# EAGLE design tvc-gamecard-GAL-v2.2.1 (EAGLE 8.3.1)
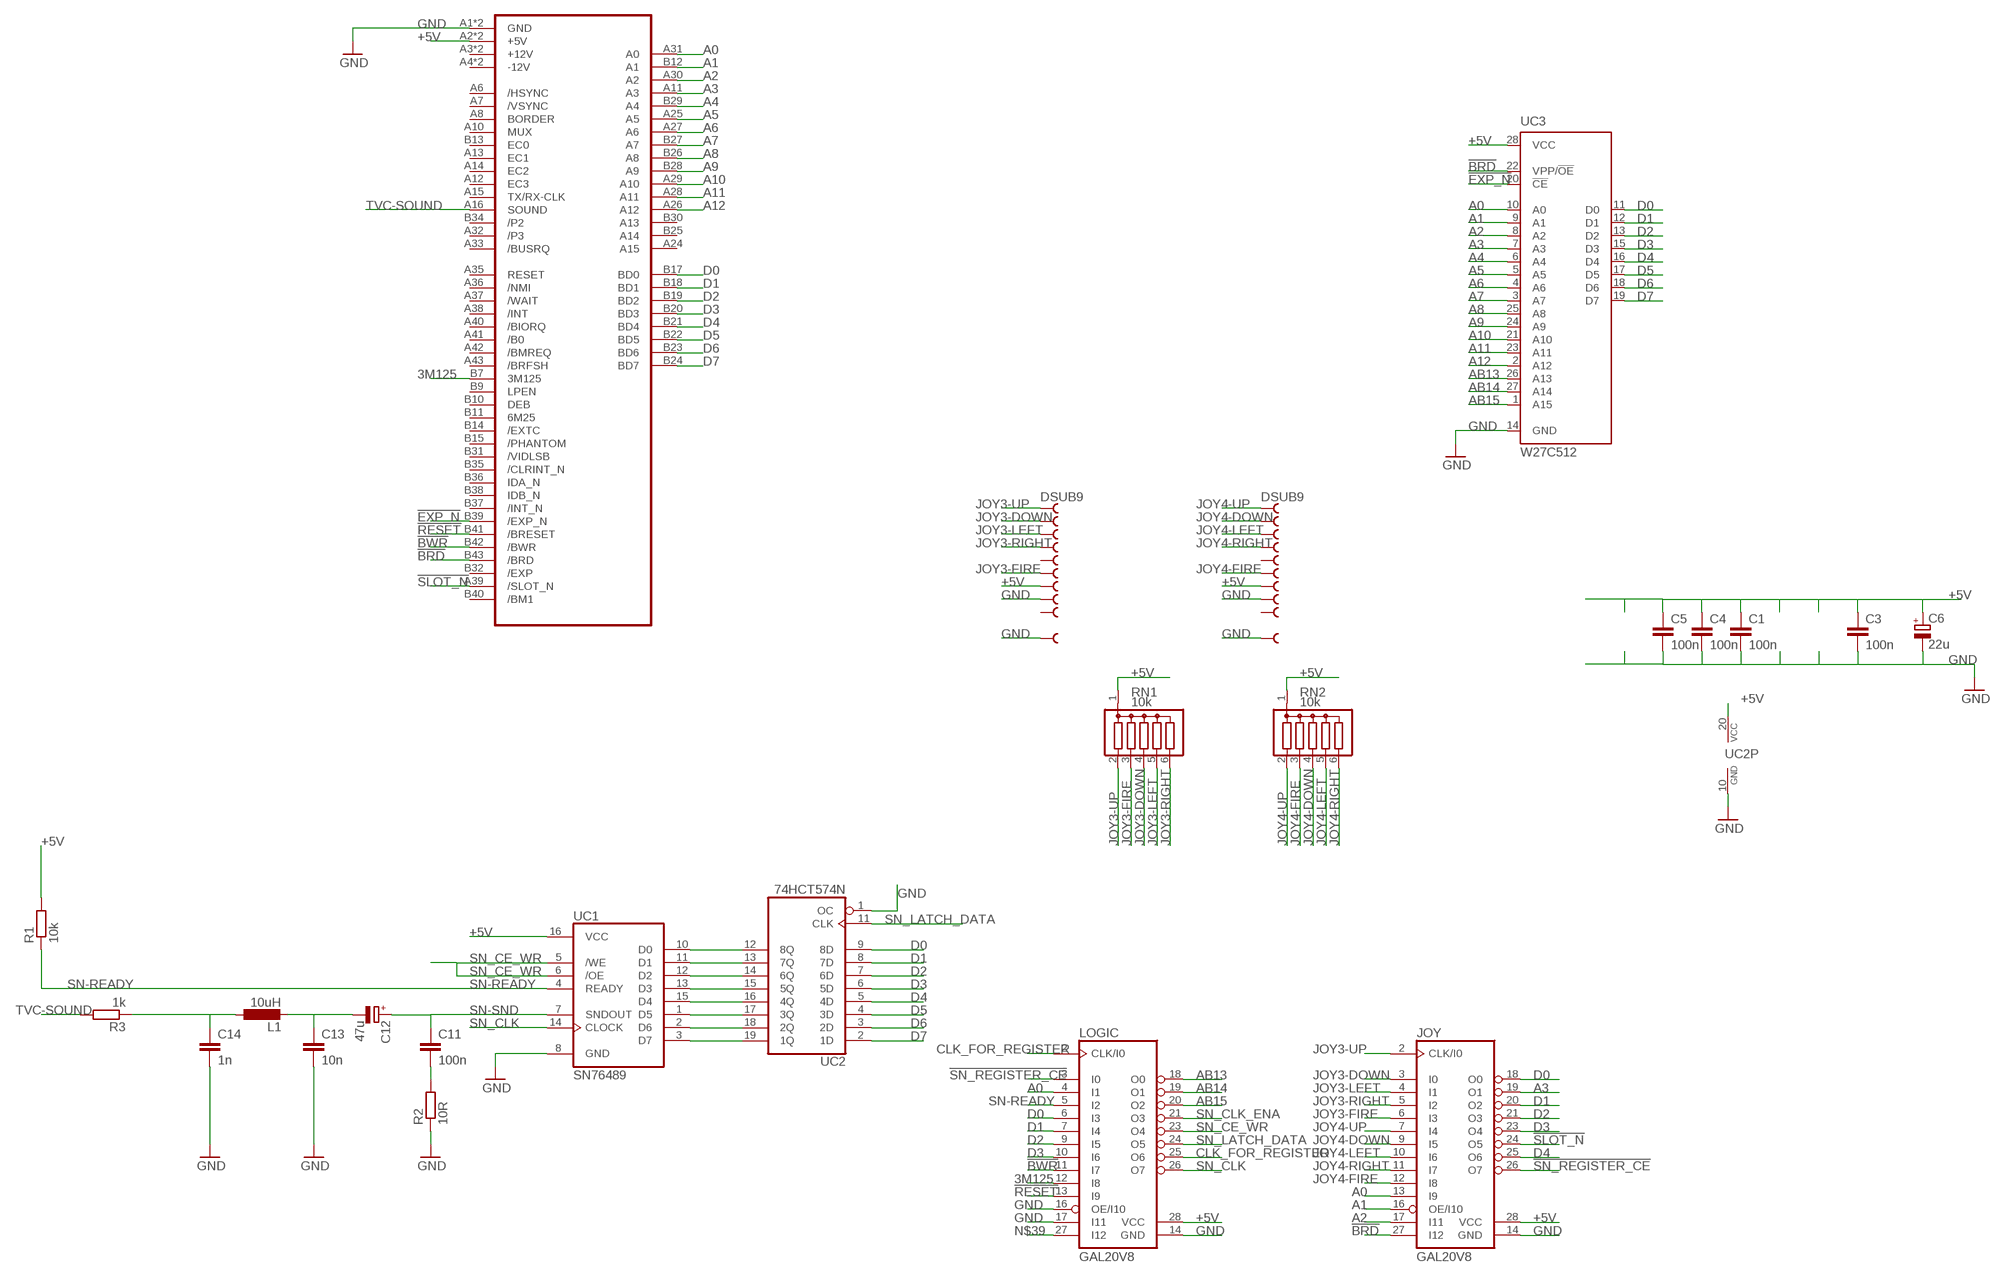
[diagram p0: schematic, sheet 1]

## Parts
C1  100n  C-EU025-030X050  [C025-030X050]
C3  100n  C-EU025-030X050  [C025-030X050]
C4  100n  C-EU025-030X050  [C025-030X050]
C5  100n  C-EU025-030X050  [C025-030X050]
C6  22u  CPOL-EUE2-4  [E2-4]
C11  100n  C-EU025-030X050  [C025-030X050]
C12  47u  CPOL-EUE2-4  [E2-4]
C13  10n  C-EU025-030X050  [C025-030X050]
C14  1n  C-EU025-030X050  [C025-030X050]
CON1  TVC-EXP-HBA-COMMON  [TVC-EXP-EDGE]
JOY  GAL20V8  GAL20V8-PLCC  [PLCC-S28-SOCKET]
JOY3  DSUB9  [H3M09RA]
JOY4  DSUB9  [H3M09RA]
L1  10uH  L-EU0207/10  [0207/10]
LOGIC  GAL20V8  GAL20V8-PLCC  [PLCC-S28-SOCKET]
R1  10k  R-EU_0204/7  [0204/7]
R2  10R  R-EU_0204/7  [0204/7]
R3  1k  R-EU_0204/7  [0204/7]
RN1  10k  G05R  [SIL6]
RN2  10k  G05R  [SIL6]
UC1  SN76489  [DIL16]
UC2  74HCT574N  [DIL20]
UC3  W27C512  [DIL28-6]

## Nets
3M125: CON1.B7(3M125) LOGIC.12(I8)
!BRD: CON1.B43(/BRD) JOY.27(I12) UC3.22(VPP/!OE)
!BWR: CON1.B42(/BWR) LOGIC.11(I7)
!EXP_N: CON1.B39(/EXP_N) UC3.20(!CE)
!RESET: CON1.B41(/BRESET) LOGIC.13(I9)
!SLOT_N: CON1.A39(/SLOT_N) JOY.24(O5)
!SN_REGISTER_CE: JOY.26(O7) LOGIC.3(I0)
+5V [power]: C1.1 C3.1 C4.1 C5.1 C6.+ CON1.A2(+5V) CON1.B2(+5V) JOY3.7 JOY4.7 JOY.28(VCC) LOGIC.28(VCC) R1.2 RN1.1 RN2.1 UC1.16(VCC) UC2.20(VCC) UC3.28(VCC)
A0: CON1.A31(A0) JOY.13(I9) LOGIC.4(I1) UC3.10(A0)
A1: CON1.B12(A1) JOY.16(OE/I10) UC3.9(A1)
A2: CON1.A30(A2) JOY.17(I11) UC3.8(A2)
A3: CON1.A11(A3) JOY.19(O1) UC3.7(A3)
A4: CON1.B29(A4) UC3.6(A4)
A5: CON1.A25(A5) UC3.5(A5)
A6: CON1.A27(A6) UC3.4(A6)
A7: CON1.B27(A7) UC3.3(A7)
A8: CON1.B26(A8) UC3.25(A8)
A9: CON1.B28(A9) UC3.24(A9)
A10: CON1.A29(A10) UC3.21(A10)
A11: CON1.A28(A11) UC3.23(A11)
A12: CON1.A26(A12) UC3.2(A12)
AB13: LOGIC.18(O0) UC3.26(A13)
AB14: LOGIC.19(O1) UC3.27(A14)
AB15: LOGIC.20(O2) UC3.1(A15)
CLK_FOR_REGISTER: LOGIC.2(CLK/I0) LOGIC.25(O6)
D0: CON1.B17(BD0) JOY.18(O0) LOGIC.6(I3) UC2.9(8D) UC3.11(D0)
D1: CON1.B18(BD1) JOY.20(O2) LOGIC.7(I4) UC2.8(7D) UC3.12(D1)
D2: CON1.B19(BD2) JOY.21(O3) LOGIC.9(I5) UC2.7(6D) UC3.13(D2)
D3: CON1.B20(BD3) JOY.23(O4) LOGIC.10(I6) UC2.6(5D) UC3.15(D3)
D4: CON1.B21(BD4) JOY.25(O6) UC2.5(4D) UC3.16(D4)
D5: CON1.B22(BD5) UC2.4(3D) UC3.17(D5)
D6: CON1.B23(BD6) UC2.3(2D) UC3.18(D6)
D7: CON1.B24(BD7) UC2.2(1D) UC3.19(D7)
GND [power]: C1.2 C3.2 C4.2 C5.2 C6.- C13.2 C14.2 CON1.A1(GND) CON1.B1(GND) JOY3.8 JOY3.P$1(S) JOY3.P$2(S) JOY4.8 JOY4.P$1(S) JOY4.P$2(S) JOY.14(GND) LOGIC.14(GND) LOGIC.16(OE/I10) LOGIC.17(I11) R2.1 UC1.8(GND) UC2.1(OC) UC2.10(GND) UC3.14(GND)
JOY3-DOWN: JOY3.2 JOY.3(I0) RN1.4
JOY3-FIRE: JOY3.6 JOY.6(I3) RN1.3
JOY3-LEFT: JOY3.3 JOY.4(I1) RN1.5
JOY3-RIGHT: JOY3.4 JOY.5(I2) RN1.6
JOY3-UP: JOY3.1 JOY.2(CLK/I0) RN1.2
JOY4-DOWN: JOY4.2 JOY.9(I5) RN2.4
JOY4-FIRE: JOY4.6 JOY.12(I8) RN2.3
JOY4-LEFT: JOY4.3 JOY.10(I6) RN2.5
JOY4-RIGHT: JOY4.4 JOY.11(I7) RN2.6
JOY4-UP: JOY4.1 JOY.7(I4) RN2.2
N$1: C11.2 R2.2
N$3: C12.- C13.1 L1.2
N$4: C14.1 L1.1 R3.1
N$6: UC1.10(D0) UC2.12(8Q)
N$7: UC1.11(D1) UC2.13(7Q)
N$8: UC1.12(D2) UC2.14(6Q)
N$9: UC1.13(D3) UC2.15(5Q)
N$10: UC1.15(D4) UC2.16(4Q)
N$11: UC1.1(D5) UC2.17(3Q)
N$12: UC1.2(D6) UC2.18(2Q)
N$13: UC1.3(D7) UC2.19(1Q)
N$39: LOGIC.27(I12)
SN-READY: LOGIC.5(I2) R1.1 UC1.4(READY)
SN-SND: C11.1 C12.+ UC1.7(SNDOUT)
SN_CE_WR: LOGIC.23(O4) UC1.5(/WE) UC1.6(/OE)
SN_CLK: LOGIC.26(O7) UC1.14(CLOCK)
SN_CLK_ENA: LOGIC.21(O3)
SN_LATCH_DATA: LOGIC.24(O5) UC2.11(CLK)
TVC-SOUND: CON1.A16(SOUND) R3.2
Unconnected: CON1.A3(+12V) CON1.A4(-12V) CON1.A6(/HSYNC) CON1.A7(/VSYNC) CON1.A8(BORDER) CON1.A10(MUX) CON1.A12(EC3) CON1.A13(EC1) CON1.A14(EC2) CON1.A15(TX/RX-CLK) CON1.A24(A15) CON1.A32(/P3) CON1.A33(/BUSRQ) CON1.A35(RESET) CON1.A36(/NMI) CON1.A37(/WAIT) CON1.A38(/INT) CON1.A40(/BIORQ) CON1.A41(/B0) CON1.A42(/BMREQ) CON1.A43(/BRFSH) CON1.B3(+12V) CON1.B4(-12V) CON1.B9(LPEN) CON1.B10(DEB) CON1.B11(6M25) CON1.B13(EC0) CON1.B14(/EXTC) CON1.B15(/PHANTOM) CON1.B25(A14) CON1.B30(A13) CON1.B31(/VIDLSB) CON1.B32(/EXP) CON1.B34(/P2) CON1.B35(/CLRINT_N) CON1.B36(IDA_N) CON1.B37(/INT_N) CON1.B38(IDB_N) CON1.B40(/BM1) JOY3.5 JOY3.9 JOY4.5 JOY4.9

## Library data of the parts
C1 C3-C5 C11 C13 C14 = rcl:C-EU: CAPACITOR, European symbol
C6 C12 = rcl:CPOL-EU: POLARIZED CAPACITOR, European symbol
CON1 = tvc-exp:TVC-EXP-HBA-COMMON: Videoton TV-Computer expansion port edge connector, common pins for 32k, 64k and 64k+
JOY LOGIC = Lattice:GAL20V8-PLCC
JOY3 JOY4 = dsub90:DSUB9
L1 = rcl:L-EU: INDUCTOR, European symbol
R1-R3 = rcl:R-EU_: RESISTOR, European symbol
RN1 RN2 = resistor-sil:G05R: SIL RESISTOR; OC_FARNELL: unknown; OC_NEWARK: unknown
UC1 = sn76489:SN76489
UC2 = 74xx-eu:74*574: 8-bit D type FLIP FLOP bus driver
UC3 = Winbond:W27C512

## Net classes
1 power: width 0.508 mm, clearance 0.254 mm

## Board
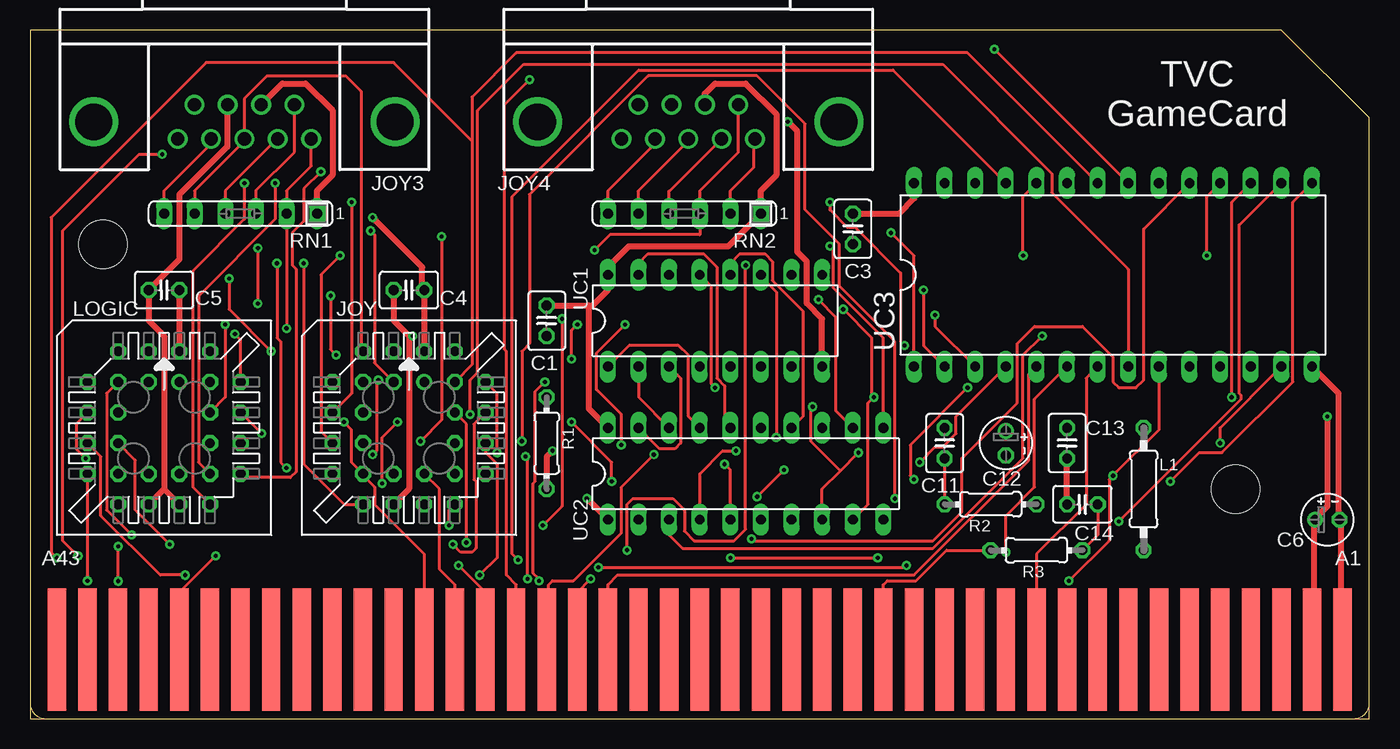
[diagram p1: board, top side]
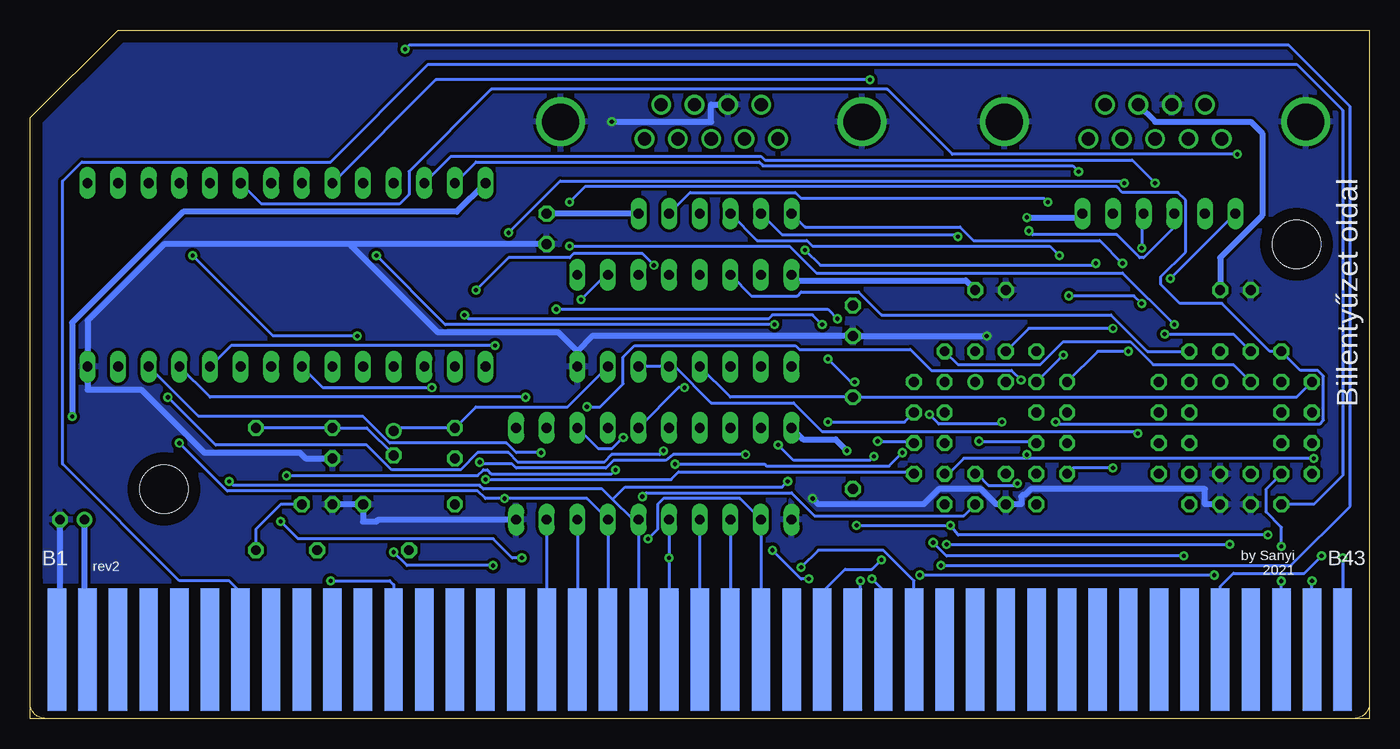
[diagram p2: board, bottom side, seen from below]

Size 111.12 x 57.14 mm. Coordinates in mm from the lower left corner, seen from the top.
Outline: 0,0 111.11,0 111.11,49.86 103.83,57.14 0,57.14 0,0
Copper layers (1*16): Top 0.035mm / dielectric 1.5mm / Bottom 0.035mm
Design rules "default *": minimum track width 10mil, minimum drill 0.35mm, track to track 6mil, track to pad 6mil, pad to pad 6mil, via to via 6mil, smd to smd 6mil, copper to edge 40mil, drill to drill 6mil, minimum pad ring 10mil, minimum via ring 8mil, stop-mask expansion 4mil, vias tented up to drill 15mil, thermal gap 10mil
Holes 4 mm at 6.03,39.37 100.01,19.05

### Footprints (pad centres in the part's own frame; a part is rotated, then mirrored left to right if it is on the bottom)
C025-030X050 = drill 0.813 octagon: 1 -1.27,0; 2 1.27,0
E2-4 = drill 0.813 pad 1.27: + -1.016,0 | drill 0.813 pad 1.27 octagon: - 1.016,0
TVC-EXP-EDGE = smd 1.524 x 10.16: A1 53.34,-5.715; A2 50.8,-5.715; A3 48.26,-5.715; A4 45.72,-5.715; A5 43.18,-5.715; A6 40.64,-5.715; A7 38.1,-5.715; A8 35.56,-5.715; A9 33.02,-5.715; A10 30.48,-5.715; A11 27.94,-5.715; A12 25.4,-5.715; A13 22.86,-5.715; A14 20.32,-5.715; A15 17.78,-5.715; A16 15.24,-5.715; A17 12.7,-5.715; A18 10.16,-5.715; A19 7.62,-5.715; A20 5.08,-5.715; A21 2.54,-5.715; A22 0,-5.715; A23 -2.54,-5.715; A24 -5.08,-5.715; A25 -7.62,-5.715; A26 -10.16,-5.715; A27 -12.7,-5.715; A28 -15.24,-5.715; A29 -17.78,-5.715; A30 -20.32,-5.715; A31 -22.86,-5.715; A32 -25.4,-5.715; A33 -27.94,-5.715; A34 -30.48,-5.715; A35 -33.02,-5.715; A36 -35.56,-5.715; A37 -38.1,-5.715; A38 -40.64,-5.715; A39 -43.18,-5.715; A40 -45.72,-5.715; A41 -48.26,-5.715; A42 -50.8,-5.715; A43 -53.34,-5.715 | smd 1.524 x 10.16 bottom: B1 53.34,-5.715; B2 50.8,-5.715; B3 48.26,-5.715; B4 45.72,-5.715; B5 43.18,-5.715; B6 40.64,-5.715; B7 38.1,-5.715; B8 35.56,-5.715; B9 33.02,-5.715; B10 30.48,-5.715; B11 27.94,-5.715; B12 25.4,-5.715; B13 22.86,-5.715; B14 20.32,-5.715; B15 17.78,-5.715; B16 15.24,-5.715; B17 12.7,-5.715; B18 10.16,-5.715; B19 7.62,-5.715; B20 5.08,-5.715; B21 2.54,-5.715; B22 0,-5.715; B23 -2.54,-5.715; B24 -5.08,-5.715; B25 -7.62,-5.715; B26 -10.16,-5.715; B27 -12.7,-5.715; B28 -15.24,-5.715; B29 -17.78,-5.715; B30 -20.32,-5.715; B31 -22.86,-5.715; B32 -25.4,-5.715; B33 -27.94,-5.715; B34 -30.48,-5.715; B35 -33.02,-5.715; B36 -35.56,-5.715; B37 -38.1,-5.715; B38 -40.64,-5.715; B39 -43.18,-5.715; B40 -45.72,-5.715; B41 -48.26,-5.715; B42 -50.8,-5.715; B43 -53.34,-5.715
PLCC-S28-SOCKET = drill 0.813: 1 1.27,3.81 | drill 0.813 octagon: 2 -1.27,6.35; 3 -1.27,3.81; 4 -3.81,6.35; 5 -6.35,3.81; 6 -3.81,3.81; 7 -6.35,1.27; 8 -3.81,1.27; 9 -6.35,-1.27; 10 -3.81,-1.27; 11 -6.35,-3.81; 12 -3.81,-6.35; 13 -3.81,-3.81; 14 -1.27,-6.35; 15 -1.27,-3.81; 16 1.27,-6.35; 17 1.27,-3.81; 18 3.81,-6.35; 19 6.35,-3.81; 20 3.81,-3.81; 21 6.35,-1.27; 22 3.81,-1.27; 23 6.35,1.27; 24 3.81,1.27; 25 6.35,3.81; 26 3.81,6.35; 27 3.81,3.81; 28 1.27,6.35
H3M09RA = drill 1.092: 1 -5.537,1.422; 2 -2.769,1.422; 3 0,1.422; 4 2.769,1.422; 5 5.537,1.422; 6 -4.153,-1.422; 7 -1.384,-1.422; 8 1.384,-1.422; 9 4.153,-1.422 | drill 3.048 pad 4.064: P$1 -12.497,0; P$2 12.497,0
0207/10 = drill 0.813 octagon: 1 -5.08,0; 2 5.08,0
0204/7 = drill 0.813 octagon: 1 -3.81,0; 2 3.81,0
SIL6 = drill 0.813 long: 1 -6.35,0; 2 -3.81,0; 3 -1.27,0; 4 1.27,0; 5 3.81,0; 6 6.35,0
DIL16 = drill 0.813 long: 1 -8.89,-3.81; 2 -6.35,-3.81; 3 -3.81,-3.81; 4 -1.27,-3.81; 5 1.27,-3.81; 6 3.81,-3.81; 7 6.35,-3.81; 8 8.89,-3.81; 9 8.89,3.81; 10 6.35,3.81; 11 3.81,3.81; 12 1.27,3.81; 13 -1.27,3.81; 14 -3.81,3.81; 15 -6.35,3.81; 16 -8.89,3.81
DIL20 = drill 0.813 long: 1 -11.43,-3.81; 2 -8.89,-3.81; 3 -6.35,-3.81; 4 -3.81,-3.81; 5 -1.27,-3.81; 6 1.27,-3.81; 7 3.81,-3.81; 8 6.35,-3.81; 9 8.89,-3.81; 10 11.43,-3.81; 11 11.43,3.81; 12 8.89,3.81; 13 6.35,3.81; 14 3.81,3.81; 15 1.27,3.81; 16 -1.27,3.81; 17 -3.81,3.81; 18 -6.35,3.81; 19 -8.89,3.81; 20 -11.43,3.81
DIL28-6 = drill 0.813 long: 1 -16.51,-7.62; 2 -13.97,-7.62; 3 -11.43,-7.62; 4 -8.89,-7.62; 5 -6.35,-7.62; 6 -3.81,-7.62; 7 -1.27,-7.62; 8 1.27,-7.62; 9 3.81,-7.62; 10 6.35,-7.62; 11 8.89,-7.62; 12 11.43,-7.62; 13 13.97,-7.62; 14 16.51,-7.62; 15 16.51,7.62; 16 13.97,7.62; 17 11.43,7.62; 18 8.89,7.62; 19 6.35,7.62; 20 3.81,7.62; 21 1.27,7.62; 22 -1.27,7.62; 23 -3.81,7.62; 24 -6.35,7.62; 25 -8.89,7.62; 26 -11.43,7.62; 27 -13.97,7.62; 28 -16.51,7.62

### Placement (x,y rotation side)
C1  42.86,33.02 270 top
C3  68.26,40.64 270 top
C4  31.43,35.56 180 top
C5  11.11,35.56 180 top
C6  107.63,16.51 0 top
C11  75.88,22.86 270 top
C12  80.96,22.86 270 top
C13  86.04,22.86 270 top
C14  87.31,17.78 180 top
CON1  55.56,11.43 0 top
JOY  31.43,24.13 0 top
JOY3  17.78,49.53 180 top
JOY4  54.61,49.53 180 top
L1  92.39,19.05 90 top
LOGIC  11.11,24.13 0 top
R1  42.86,22.86 270 top
R2  79.69,17.78 180 top
R3  83.5,13.97 180 top
RN1  17.46,41.91 180 top
RN2  54.29,41.91 180 top
UC1  56.83,33.02 0 top
UC2  59.37,20.32 0 top
UC3  89.85,36.83 0 top

### Tracks (layer width: path | path; a pad name or v marks a point on that pad's centre or on a via)
3M125
  Bottom 0.254: LOGIC.12 4.6,17.78 2.22,20.16 2.22,50.48 6.03,54.29 78.1,54.29 86.2,46.2 106.84,46.2 108.43,44.61 108.43,21.11 98.74,11.43 94.62,11.43 93.66,10.48 CON1.B7
!BRD  (via drill 0.35)
  Top 0.254: JOY.27 36.67,29.37 36.67,47.94 | 36.67,47.94 36.67,51.59 40.32,55.24 77.79,55.24 UC3.22 | v2.22,13.34 1.75,13.81 1.75,41.59 14.6,54.45 30.16,54.45 36.67,47.94
  Bottom 0.254: v2.22,13.34 CON1.B43
!BWR  (via drill 0.35)
  Top 0.254: v4.76,11.43 LOGIC.11
  Bottom 0.254: CON1.B42 v4.76,11.43
!EXP_N  (via drill 0.35)
  Top 0.254: v10.95,46.83 9.05,46.83 2.7,40.48 2.7,14.76 v3.97,13.49
  Bottom 0.254: UC3.20 91.92,42.7 80.49,42.7 79.69,43.5 79.69,45.4 72.87,52.23 40,52.23 34.61,46.83 v10.95,46.83 | v3.97,13.49 5.4,12.06 11.27,12.06 12.38,10.95 CON1.B39
!RESET  (via drill 0.35)
  Top 0.254: v7.3,11.41 v7.3,14.29
  Bottom 0.254: CON1.B41 v7.3,11.41 | v7.3,14.29 7.3,15.88 8.57,17.14 8.57,19.05 LOGIC.13
!SLOT_N  (via drill 0.35)
  Top 0.254: JOY.24 36.2,24.45 v36.2,14.61 | v15.4,13.49 12.38,10.48 CON1.A39
  Bottom 0.254: v36.2,14.61 35.08,13.49 v15.4,13.49
!SN_REGISTER_CE
  Bottom 0.254: LOGIC.3 11.27,29.37 17.94,29.37 19.84,31.27 25.4,31.27 27.3,29.37 34.13,29.37 JOY.26
+5V  (via drill 0.35)
  Top 0.508: 106.23,5.84 CON1.B2 106.36,6.03 106.52,6.19 106.52,16.51 C6.+ 106.68,16.67 107.63,17.62 v107.63,25.08 | RN1.1 23.81,43.81 25.08,45.09 25.08,50.48 22.86,52.7 20.92,52.7 JOY3.7 | JOY.28 C4.1 32.54,35.72 32.54,37.47 v28.42,41.59 | C5.1 LOGIC.28 | C1.1 46.35,34.29 | 46.35,34.29 46.67,34.29 47.94,35.56 UC1.16 48.1,36.99 48.1,37.62 49.69,39.21 57.94,39.21 RN2.1 60.64,43.81 61.91,45.09 61.91,50.16 59.37,52.7 56.83,52.7 55.99,51.87 JOY4.7 | C3.1 72.07,41.91 73.34,43.18 UC3.28 | R1.2 42.86,21.75 v43.34,22.23 | UC2.20 46.35,25.72 46.35,34.29
  Bottom 0.508: C6.+ 106.62,5.97 CON1.B2 | C5.1 12.38,38.26 8.89,41.75 8.89,48.58 9.84,49.53 17.78,49.53 19.16,50.91 JOY3.7 | v43.34,22.23 44.29,23.18 46.99,23.18 UC2.20 | RN2.1 C3.1 | C4.1 33.5,36.35 47.47,36.35 UC1.16 | RN1.1 24.13,41.59 v28.42,41.59 | v107.63,25.08 107.63,32.86 98.43,42.07 75.72,42.07 UC3.28
A0  (via drill 0.35)
  Top 0.254: v26.03,24.61 26.67,23.97 26.67,21.27 JOY.13 27.62,20.16 28.57,19.21 28.57,17.78 32.7,13.65 32.7,9.84 32.07,6.35 CON1.A31 | v72.55,30.96 72.23,31.27 72.23,36.99 68.42,40.8 67.79,40.8 66.36,42.23 v66.36,42.86
  Bottom 0.254: v26.03,24.61 25.88,24.45 4.13,24.45 3.81,24.77 3.81,28.42 4.29,28.89 5.71,28.89 LOGIC.4 8.25,30.48 12.22,34.45 15.72,34.45 17.3,36.04 17.3,36.67 15.24,38.73 15.24,43.02 15.87,43.66 20.48,43.66 20.96,44.13 65.09,44.13 v66.36,42.86 | UC3.10 94.46,30.96 v72.55,30.96
A1  (via drill 0.35)
  Top 0.254: v62.55,20.64 v60.32,18.41 | UC3.9 93.66,23.97 v89.85,20.16 89.54,19.84 89.54,14.76 v86.2,11.43
  Bottom 0.254: JOY.16 33.65,16.83 46.04,16.83 47.94,18.73 60.01,18.73 v60.32,18.41 | v62.55,20.64 62.86,20.32 72.87,20.32 73.18,20.64 73.5,20.64 73.98,20.16 v89.85,20.16 | v86.2,11.43 81.28,11.43 80.96,11.11 CON1.B12
A2  (via drill 0.35)
  Top 0.254: JOY.17 33.97,19.05 33.97,12.38 35.24,11.11 CON1.A30 | UC3.8 91.12,37.31 84.77,43.66 84.77,45.24 75.72,54.29 40.96,54.29 37.15,50.48 37.15,28.73 36.51,28.1 v36.51,25.24 | v30.48,24.61 29.21,23.34 v29.21,19.53
  Bottom 0.254: v36.51,25.24 35.72,24.45 30.64,24.45 v30.48,24.61 | v29.21,19.53 29.37,19.37 31.59,19.37 32.54,20.32 JOY.17
A3  (via drill 0.35)
  Top 0.254: v73.34,19.84 73.03,20.16 73.03,22.7 v77.79,27.46 | CON1.A11 84.14,6.35 83.82,8.89 83.5,8.89 83.5,13.65 87.63,17.78 87.63,28.26 UC3.7
  Bottom 0.254: JOY.19 37.94,20.48 57.31,20.48 57.94,19.84 v73.34,19.84 | v77.79,27.46 86.84,27.46 UC3.7
A4  (via drill 0.35)
  Top 0.254: UC3.6 83.34,26.51 83.34,19.21 80.96,16.83 v80.96,13.81 | v72.71,12.7 72.55,12.54 v47.15,12.54
  Bottom 0.254: v80.96,13.81 79.85,12.7 v72.71,12.7 | v47.15,12.54 45.72,13.97 40.32,13.97 37.78,11.43 CON1.B29
A5
  Top 0.254: UC3.5 82.87,28.57 82.87,21.43 73.34,11.91 48.74,11.91 47.94,11.11 CON1.A25
A6  (via drill 0.35)
  Top 0.254: UC3.4 76.84,25.08 76.84,23.65 75.72,22.54 75.09,22.54 v73.82,21.27 | v51.75,21.91 49.05,19.21 49.05,15.4 45.09,11.43 43.34,11.43 43.02,11.11 43.02,5.87 CON1.A27
  Bottom 0.254: v73.82,21.27 73.66,21.11 71.12,21.11 70.8,20.8 63.34,20.8 62.71,21.43 58.42,21.43 57.78,21.91 v51.75,21.91
A7  (via drill 0.35)
  Top 0.254: UC3.3 75.09,32.54 v75.09,33.5 | v45.4,32.7 44.93,32.23 v44.93,29.84 | v42.7,27.94 41.91,27.15 41.91,19.68 41.75,19.53 41.75,12.06 42.23,11.59 v42.23,11.43
  Bottom 0.254: v75.09,33.5 74.77,33.18 49.85,33.18 49.53,33.5 46.2,33.5 v45.4,32.7 | v44.93,29.84 43.02,27.94 v42.7,27.94 | v42.23,11.43 42.23,5.71 CON1.B27
A8  (via drill 0.35)
  Top 0.254: UC3.25 71.6,53.82 50.48,53.82 40,43.34 40,13.65 v40.48,13.18
  Bottom 0.254: v40.48,13.18 41.28,12.38 43.5,12.38 45.4,10.48 CON1.B26
A9  (via drill 0.35)
  Top 0.254: UC3.24 82.39,43.34 v82.39,38.42 | v49.37,32.7 46.99,30.32 46.99,27.3 49.05,25.24 v49.05,22.7 | v41.12,21.75 41.28,21.59 v41.28,11.59
  Bottom 0.254: v82.39,38.42 76.68,32.7 v49.37,32.7 | v49.05,22.7 47.78,21.43 41.43,21.43 v41.12,21.75 | v41.28,11.59 40.32,10.64 CON1.B28
A10  (via drill 0.35)
  Top 0.254: v80.01,55.56 UC3.21 | v35.56,12.7 37.78,10.48 CON1.A29
  Bottom 0.254: v80.01,55.56 79.69,55.88 6.67,55.88 1.59,50.8 1.59,17.62 6.51,12.7 v35.56,12.7
A11  (via drill 0.35)
  Top 0.254: v41.43,53.02 39.37,50.96 39.37,30.64 39.53,30.48 39.53,11.91 40.32,11.11 CON1.A28
  Bottom 0.254: UC3.23 77.47,53.02 v41.43,53.02
A12  (via drill 0.35)
  Top 0.254: UC3.2 74.14,30.96 v74.14,35.56 | v59.37,37.62 59.37,15.72 58.42,14.76 55.09,14.76 54.29,15.56 54.29,17.3 53.34,18.26 50.01,18.26 49.53,17.78 v49.53,13.97 | v46.51,11.59 45.4,10.48 CON1.A26
  Bottom 0.254: v74.14,35.56 71.44,38.26 66.36,38.26 66.04,38.58 60.32,38.58 v59.37,37.62 | v49.53,13.97 47.15,11.59 v46.51,11.59
AB13  (via drill 0.35)
  Top 0.254: LOGIC.18 13.49,19.21 13.49,37.15 17.78,41.43 v17.78,44.45
  Bottom 0.254: v17.78,44.45 19.69,46.35 50.17,46.35 50.48,46.67 76.2,46.67 UC3.26
AB14  (via drill 0.35)
  Top 0.254: LOGIC.19 17.94,20 21.59,20 22.07,20.48 22.07,37.31 21.75,37.62 21.75,40.32 22.7,41.27 22.7,43.97 v24.13,45.4
  Bottom 0.254: v24.13,45.4 24.61,45.88 50.32,45.88 50.64,46.2 74.14,46.2 UC3.27
AB15  (via drill 0.35)
  Top 0.254: LOGIC.20 13.97,21.27 13.97,35.08 20.32,41.43 v20.32,44.45 | v71.44,40.32 73.34,38.42 UC3.1
  Bottom 0.254: v20.32,44.45 20.48,44.61 67.15,44.61 v71.44,40.32
CLK_FOR_REGISTER  (via drill 0.35)
  Top 0.254: v16.99,31.91 17.46,31.43 LOGIC.25
  Bottom 0.254: LOGIC.2 11.27,31.91 v16.99,31.91
D0  (via drill 0.35)
  Top 0.254: JOY.18 34.77,17.3 v34.77,16.03 | v8.41,15.24 6.35,17.3 6.35,26.99 LOGIC.6 | UC2.9 69.53,17.78 69.53,26.19 v70.01,26.67 69.85,26.67 69.85,31.59 v67.47,33.97 | v42.54,16.03 44.13,17.62 v44.13,33.18
  Bottom 0.254: UC2.9 CON1.B17 | v8.41,15.24 34.13,15.24 v34.77,16.03 v42.54,16.03 | UC3.11 96.2,26.67 v70.01,26.67 | v44.13,33.18 44.93,33.97 v67.47,33.97
D1  (via drill 0.35)
  Top 0.254: v4.6,21.59 3.81,22.38 3.81,24.45 LOGIC.7 | 67.23,20.56 65.72,19.05 UC2.8 | 67.23,20.56 v68.74,22.07 | v28.42,21.91 28.73,22.23 28.73,27.94 v28.89,28.1 | v64.93,25.88 64.77,25.72 64.77,23.02 67.23,20.56
  Bottom 0.254: UC2.8 CON1.B18 | JOY.20 34.92,20.32 33.65,21.59 28.42,21.59 | v4.6,21.59 28.42,21.59 | UC3.12 97.15,25.08 83.5,25.08 81.28,22.86 71.6,22.86 70.8,22.07 v68.74,22.07 | v28.42,21.91 28.42,21.59 | v28.89,28.1 29.69,28.89 36.35,28.89 38.1,30.64 47.31,30.64 47.63,30.96 60.96,30.96 61.91,30 61.91,27.78 63.82,25.88 v64.93,25.88
D2  (via drill 0.35)
  Top 0.254: LOGIC.9 5.87,21.75 5.87,16.83 10.8,11.91 v12.86,11.91 | v37.31,11.91 38.74,13.34 38.74,21.11 37.78,22.07 JOY.21 | UC3.13 98.74,24.13 v98.74,22.86 | v40.8,23.02 40.8,30.48 41.43,31.11 41.43,43.5 51.28,53.34 60.32,53.34 64.29,49.37 64.29,42.23 67.15,39.37 67.15,35.88 71.76,31.27 v71.76,18.26
  Bottom 0.254: CON1.B19 UC2.7 64.93,18.26 v71.76,18.26 73.34,18.26 73.98,18.89 94.77,18.89 v98.74,22.86 | v37.31,11.91 v12.86,11.91 | JOY.21 37.94,23.02 v40.8,23.02
D3  (via drill 0.35)
  Top 0.254: LOGIC.10 8.73,21.43 8.73,17.3 v11.59,14.45 | v35.08,14.45 35.72,13.81 36.67,13.81 36.99,14.13 36.99,19.68 36.83,19.84 36.83,24.45 JOY.23 | UC3.15 104.78,42.86 104.78,27.94 98.9,22.07 97,22.07 v94.62,19.68 | v44.93,24.61 48.26,21.27 v48.26,19.68
  Bottom 0.254: CON1.B20 UC2.6 61.12,16.51 62.79,18.18 | v35.08,14.45 v11.59,14.45 | v94.62,19.68 94.3,19.37 73.82,19.37 73.5,19.05 63.66,19.05 62.79,18.18 | JOY.23 38.58,24.61 v44.93,24.61 | v48.26,19.68 48.74,19.21 61.75,19.21 62.79,18.18
D4  (via drill 0.35)
  Top 0.254: JOY.25 38.74,26.99 v38.74,22.07 | v57.63,21.11 58.1,20.64 UC2.5 | UC3.16 100.33,40.96 100.33,26.99 100.49,26.83 100.49,26.51 v90.33,16.35 | v58.1,13.34 v70.33,13.34
  Bottom 0.254: 58.1,10.43 CON1.B21 v58.1,13.34 UC2.5 | v38.74,22.07 39.85,20.95 50.01,20.95 50.17,21.11 v57.63,21.11 | v90.33,16.35 88.9,14.92 72.71,14.92 71.12,13.34 v70.33,13.34
D5  (via drill 0.35)
  Top 0.254: UC3.17 99.7,42.86 v99.7,26.67 | UC2.4 55.56,20.32 57.47,22.23 v58.58,22.23
  Bottom 0.254: UC2.4 CON1.B22 | v99.7,26.67 95.73,22.7 83.18,22.7 81.12,20.64 75.41,20.64 73.98,22.07 71.44,22.07 70.64,21.27 63.5,21.27 62.86,21.91 58.9,21.91 v58.58,22.23
D6  (via drill 0.35)
  Top 0.254: UC3.18 97.63,43.34 v97.63,38.42 | v83.98,31.75 82.39,30.16 82.39,21.59 74.93,14.13 54.13,14.13 53.02,15.24 UC2.3
  Bottom 0.254: UC2.3 CON1.B23 | v97.63,38.42 90.96,31.75 v83.98,31.75
D7  (via drill 0.35)
  Top 0.254: UC3.19 92.39,40.64 92.39,28.1 91.76,27.46 90.33,27.46 89.85,27.94 89.85,30 87.31,32.54 83.34,32.54 81.92,31.11 81.92,26.19 77.31,21.59 77.31,17.14 74.93,14.76 59.85,14.76 v59.85,14.92
  Bottom 0.254: CON1.B24 UC2.2 52.23,18.26 58.58,18.26 59.06,17.78 59.06,15.72 v59.85,14.92
GND  (via drill 0.35)
  Top 0.508: 109.03,5.84 CON1.B1 108.9,6.03 108.74,6.19 108.74,16.51 C6.- 108.59,16.67 108.59,26.99 UC3.14 | C4.2 30.16,33.02 31.43,31.75 | 31.43,31.75 31.43,19.05 JOY.14 | 11.11,19.05 11.11,31.75 9.84,33.02 C5.2 12.38,38.1 12.38,43.5 16.35,47.47 16.35,50.8 16.4,50.84 JOY3.8 | 11.11,19.05 LOGIC.14 | v46.2,18.26 UC2.1 | 11.11,19.05 LOGIC.16 | v62.86,49.53 63.66,48.74 63.66,38.73 64.45,37.94 64.45,34.45 65.72,33.18 UC1.8 | C14.2 C13.2 | v31.75,31.75 31.43,31.75
  Bottom 0.508: 65.72,30.48 64.45,31.75 C1.2 v31.75,31.75 | 65.72,30.48 UC1.8 | C3.2 84.45,39.37 | 84.45,39.37 100.01,39.37 106.36,33.02 UC3.14 106.36,27.3 101.92,27.3 96.68,22.07 88.74,22.07 88.26,21.59 C13.2 | C6.- 108.65,5.97 CON1.B1 | v46.2,18.26 45.72,17.78 36.99,17.78 35.72,19.05 32.23,19.05 30.96,17.78 JOY.14 28.89,17.78 28.89,18.41 28.73,18.57 28.57,18.57 28.1,19.05 13.65,19.05 13.65,17.78 LOGIC.16 | 53.34,50.8 53.34,50.96 54.61,50.96 54.61,49.53 v62.86,49.53 | UC2.10 82.23,16.51 82.39,16.35 83.5,16.35 R2.1 C14.2 | 65.72,30.48 67.31,32.07 77.31,32.07 84.45,39.21 84.45,39.37
  pour Bottom: -0.32,57.78 -0.32,11.43 111.76,11.43 112.08,50.16 104.46,57.78
JOY3-DOWN  (via drill 0.35)
  Top 0.254: 19.69,47.31 19.91,47.54 | 19.69,47.31 16.19,43.81 RN1.4 | JOY.3 28.57,29.53 28.57,40.16 v28.26,40.48 | JOY3.2 20.49,48.11 19.69,47.31
  Bottom 0.254: v28.26,40.48 27.94,40.16 20.96,40.16 19.05,38.26 18.73,38.26 16.19,40.8 RN1.4
JOY3-FIRE  (via drill 0.35)
  Top 0.254: RN1.3 18.73,43.81 21.93,47.02 JOY3.6 | v25.4,30.16 24.92,30.64 v24.92,35.08 | v18.89,39.05 v18.89,34.45
  Bottom 0.254: v25.4,30.16 JOY.6 | v24.92,35.08 19.53,35.08 v18.89,34.45 | v18.89,39.05 18.89,41.91 RN1.3
JOY3-LEFT
  Top 0.254: RN1.5 13.65,43.81 17.78,47.94 JOY3.3 17.78,51.44 19.69,53.34 26.19,53.34 27.46,52.07 27.46,30.64 JOY.4
JOY3-RIGHT  (via drill 0.35)
  Top 0.254: RN1.6 11.11,43.81 14.92,47.62 14.92,48.02 JOY3.4 | v20,30.48 16.51,33.97 v16.51,36.51
  Bottom 0.254: JOY.5 22.54,30.48 v20,30.48 | RN1.6 v16.51,36.51
JOY3-UP  (via drill 0.35)
  Top 0.254: v21.27,32.38 RN1.2 21.27,43.81 23.32,45.86 JOY3.1
  Bottom 0.254: JOY.2 28.26,32.38 v21.27,32.38
JOY4-DOWN  (via drill 0.35)
  Top 0.254: RN2.4 53.02,43.81 | 53.02,43.81 53.09,43.81 | JOY.9 24.13,23.81 24.13,36.83 v25.72,38.42 | 53.02,43.81 53.09,43.81 | 53.09,43.81 JOY4.2
  Bottom 0.254: v25.72,38.42 26.51,39.21 46.2,39.21 46.67,39.69 50.8,39.69 RN2.4
JOY4-FIRE  (via drill 0.35)
  Top 0.254: v22.7,37.78 22.7,21.11 26.03,17.78 JOY.12 | v46.83,38.89 48.1,40.16 55.56,40.16 RN2.3 55.56,43.81 58.74,46.99 58.74,50.93 JOY4.6
  Bottom 0.254: v22.7,37.78 22.86,37.62 45.56,37.62 v46.83,38.89
JOY4-LEFT  (via drill 0.35)
  Top 0.254: RN2.5 50.48,43.81 54.29,47.62 54.29,47.79 JOY4.3 | v32.39,23.02 34.13,24.77 v34.13,40.01
  Bottom 0.254: JOY.10 27.78,23.02 v32.39,23.02 | v34.13,40.01 34.29,40.16 48.74,40.16 RN2.5
JOY4-RIGHT  (via drill 0.35)
  Top 0.254: RN2.6 47.94,43.81 51.75,47.62 51.75,48.02 JOY4.4 | v21.27,20.8 20.8,21.27 20.8,31.27 20.48,31.59 v20.48,37.78
  Bottom 0.254: JOY.11 24.61,20.8 v21.27,20.8 | v20.48,37.78 22.38,39.69 32.86,39.69 33.97,40.8 46.83,40.8 RN2.6
JOY4-UP  (via drill 0.35)
  Top 0.254: RN2.2 58.1,43.81 60.01,45.72 60.01,47.97 JOY4.1 | JOY.7 26.67,26.99 v26.67,42.86
  Bottom 0.254: v26.67,42.86 26.99,43.18 47.15,43.18 47.63,43.66 56.36,43.66 RN2.2
N$1
  Top 0.254: C11.2 R2.2
N$3
  Bottom 0.254: C12.- 80.96,21.91 83.18,24.13 C13.1 L1.2
N$4
  Top 0.254: R3.1 88.58,15.24 C14.1
  Bottom 0.254: C14.1 90.33,17.78 92.39,15.72 L1.1
N$6  (via drill 0.35)
  Top 0.254: UC2.12 66.83,25.56 66.83,33.34 v65.4,34.77
  Bottom 0.254: v65.4,34.77 63.34,36.83 UC1.10
N$7  (via drill 0.35)
  Top 0.254: v61.91,23.34 61.91,35.4 60.64,36.67 UC1.11
  Bottom 0.254: UC2.13 63.98,22.38 62.86,22.38 v61.91,23.34
N$8
  Top 0.254: UC2.14 64.14,25.08 64.14,33.81 61.6,36.35 61.6,37.94 60.96,38.58 58.9,38.58 58.1,37.78 UC1.12
N$9  (via drill 0.35)
  Top 0.254: v56.83,27.46 56.52,27.78 56.52,35.88 UC1.13
  Bottom 0.254: UC2.15 57.31,27.46 v56.83,27.46
N$10
  Top 0.254: UC2.16 57.63,24.61 57.63,27.62 56.99,28.26 56.99,37.47 55.88,38.58 51.28,38.58 50.48,37.78 UC1.15
N$11
  Top 0.254: UC1.1 49.69,30.96 53.82,30.96 54.61,30.16 54.61,25.08 UC2.17
N$12
  Top 0.254: UC2.18 50.48,26.67 UC1.2
N$13
  Top 0.254: UC2.19 52.23,22.38 53.5,22.38 53.97,22.86 53.97,28.26 UC1.3
SN-READY
  Bottom 0.254: LOGIC.5 6.03,26.67 R1.1 53.02,26.67 UC1.4
SN-SND
  Bottom 0.254: UC1.7 66.52,25.88 74.14,25.88 C11.1 80.8,24.13 80.96,23.97 C12.+
SN_CE_WR  (via drill 0.35)
  Top 0.254: v19.21,23.65 LOGIC.23
  Bottom 0.254: v19.21,23.65 19.37,23.81 45.4,23.81 47.78,26.19 54.61,26.19 57.63,29.21 UC1.5 UC1.6
SN_CLK
  Bottom 0.254: LOGIC.26 18.42,30.48 21.43,33.5 40.48,33.5 42.39,35.4 47.15,35.4 47.47,35.08 51.28,35.08 UC1.14
SN_LATCH_DATA  (via drill 0.35)
  Top 0.254: LOGIC.24 16.19,26.67 v16.19,32.7 | v66.36,39.21 66.68,38.89 66.68,35.72 70.8,31.59 UC2.11
  Bottom 0.254: v16.19,32.7 20.48,36.99 45.88,36.99 48.1,39.21 v66.36,39.21
TVC-SOUND
  Top 0.254: R3.2 76.04,13.97 73.5,11.43 71.12,11.43 70.8,11.11 CON1.A16

### Text on the board
tPlace: TVC / GameCard
bPlace: Billentyűzet oldal | by Sanyi / 2021 | rev2